# EAGLE design ADC (EAGLE 8.4.2)
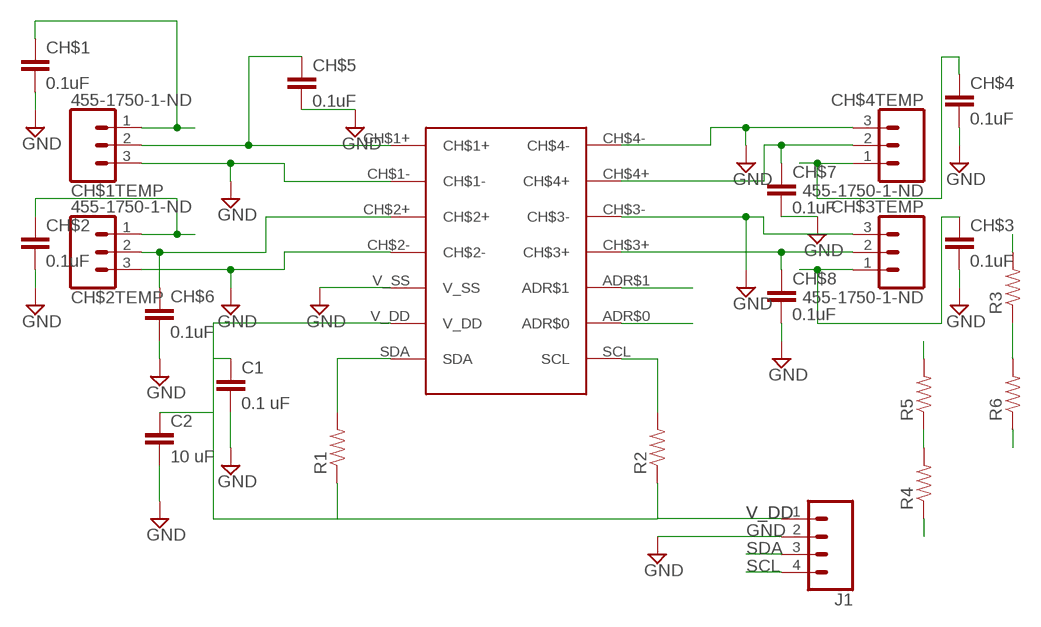
[diagram p0: schematic, sheet 1]

## Parts
C1  0.1 uF  CAPACITOR0805  [0805]
C2  10 uF  CAPACITOR0805  [0805]
CH$1  0.1uF  CAPACITOR0805  [0805]
CH$1TEMP  455-1750-1-ND  CONN_03  [1X03]
CH$2  0.1uF  CAPACITOR0805  [0805]
CH$2TEMP  455-1750-1-ND  CONN_03  [1X03]
CH$3  0.1uF  CAPACITOR0805  [0805]
CH$3TEMP  455-1750-1-ND  CONN_03  [1X03]
CH$4  0.1uF  CAPACITOR0805  [0805]
CH$4TEMP  455-1750-1-ND  CONN_03  [1X03]
CH$5  0.1uF  CAPACITOR0805  [0805]
CH$6  0.1uF  CAPACITOR0805  [0805]
CH$7  0.1uF  CAPACITOR0805  [0805]
CH$8  0.1uF  CAPACITOR0805  [0805]
J1  CONN_04  [1X04]
R1  RESISTOR0805  [0805]
R2  RESISTOR0805  [0805]
R3  RESISTOR0805  [0805]
R4  RESISTOR0805  [0805]
R5  RESISTOR0805  [0805]
R6  RESISTOR0805  [0805]
U$1  MCP3428-E/SL  [MICROCHIP_MCP3428]

## Nets
ADR0: R4.2 R5.1 U$1.ADR$0
ADR1: R3.1 R6.2 U$1.ADR$1
CH$2+: CH$2TEMP.2 CH$6.1 U$1.CH$2+
CH$3+: CH$3TEMP.2 CH$8.1 U$1.CH$3+
CH$4+: CH$4TEMP.2 CH$7.1 U$1.CH$4+
GND: C1.2 C2.2 CH$1.2 CH$1TEMP.3 CH$2.2 CH$2TEMP.3 CH$3.2 CH$3TEMP.3 CH$4.2 CH$4TEMP.3 CH$5.2 CH$6.2 CH$7.2 CH$8.2 J1.2 R4.1 R6.1 U$1.CH$1- U$1.CH$2- U$1.CH$3- U$1.CH$4- U$1.V_SS
N$7: CH$1TEMP.2 CH$5.1 U$1.CH$1+
SCL: J1.4 R2.2 U$1.SCL
SDA: J1.3 R1.2 U$1.SDA
V_DD: C1.1 C2.1 CH$1.1 CH$1TEMP.1 CH$2.1 CH$2TEMP.1 CH$3.1 CH$3TEMP.1 CH$4.1 CH$4TEMP.1 J1.1 R1.1 R2.1 R3.2 R5.2 U$1.V_DD

## Library data of the parts
C1 C2 CH$1-CH$8 = DubSat1 Components:CAPACITOR: Capacitor Standard 0603 ceramic capacitor, and 0.1" leaded capacitor.
CH$1TEMP CH$2TEMP CH$3TEMP CH$4TEMP = SparkFun-Connectors:CONN_03: Multi connection point. Often used as Generic Header-pin footprint for 0.1 inch spaced/style header connections On any of the 0.1 inch spaced packages, you can populate with these: Break Away Headers - Straight <https://www.sparkfun.com/products/116> (PRT-00116) Break Away Male Headers - Right Angle <https://www.sparkfun.com/products/553> (PRT-00553) Female Headers <https://www.sparkfun.com/products/115> (PRT-00115) Break Away Headers - Machine Pin <https://www.sparkfun.com/products/117> (PRT-00117) Break Away Female Headers - Swiss Machine Pin <https://www.sparkfun.com/products/743> (PRT-00743) Stackable Header - 3 Pin (Female, 0.1") <https://www.sparkfun.com/products/13875> (PRT-13875) For SCREWTERMINALS and SPRING TERMINALS visit here: Screw Terimnals on SparkFun.com <https://www.sparkfun.com/search/results?term=Screw+Terminals> (5mm/3.5mm/2.54mm spacing) This device is also useful as a general connection point to wire up your design to another part of your project. Our various solder wires solder well into these plated through hole pads. Hook-Up Wire - Assortment (Stranded, 22 AWG) <https://www.sparkfun.com/products/11375> (PRT-11375) Hook-Up Wire - Assortment (Solid Core, 22 AWG) <https://www.sparkfun.com/products/11367> (PRT-11367) View the entire wire category on our website here <https://www.sparkfun.com/categories/141> Special notes: Molex polarized connector foot print use with SKU : PRT-08232 with associated crimp pins and housings.; PROD_ID: XXX-00000
J1 = SparkFun-Connectors:CONN_04: Multi connection point. Often used as Generic Header-pin footprint for 0.1 inch spaced/style header connections On any of the 0.1 inch spaced packages, you can populate with these: Break Away Headers - Straight <https://www.sparkfun.com/products/116> (PRT-00116) Break Away Male Headers - Right Angle <https://www.sparkfun.com/products/553> (PRT-00553) Female Headers <https://www.sparkfun.com/products/115> (PRT-00115) Break Away Headers - Machine Pin <https://www.sparkfun.com/products/117> (PRT-00117) Break Away Female Headers - Swiss Machine Pin <https://www.sparkfun.com/products/743> (PRT-00743) For SCREWTERMINALS and SPRING TERMINALS visit here: Screw Terimnals on SparkFun.com <https://www.sparkfun.com/search/results?term=Screw+Terminals> (5mm/3.5mm/2.54mm spacing) This device is also useful as a general connection point to wire up your design to another part of your project. Our various solder wires solder well into these plated through hole pads. Hook-Up Wire - Assortment (Stranded, 22 AWG) <https://www.sparkfun.com/products/11375> (PRT-11375) Hook-Up Wire - Assortment (Solid Core, 22 AWG) <https://www.sparkfun.com/products/11367> (PRT-11367) View the entire wire category on our website here <https://www.sparkfun.com/categories/141> Special notes: Molex polarized connector foot print use with SKU : PRT-08231 with associated crimp pins and housings. 1MM SMD Version SKU: PRT-10208; PROD_ID: CONN-09696
R1-R6 = DubSat1 Components:RESISTOR: Resistor Basic schematic elements and footprints for 0603, 1206, and PTH resistors.
U$1 = DubSat1 Components:MCP3428-E/SL

## Board
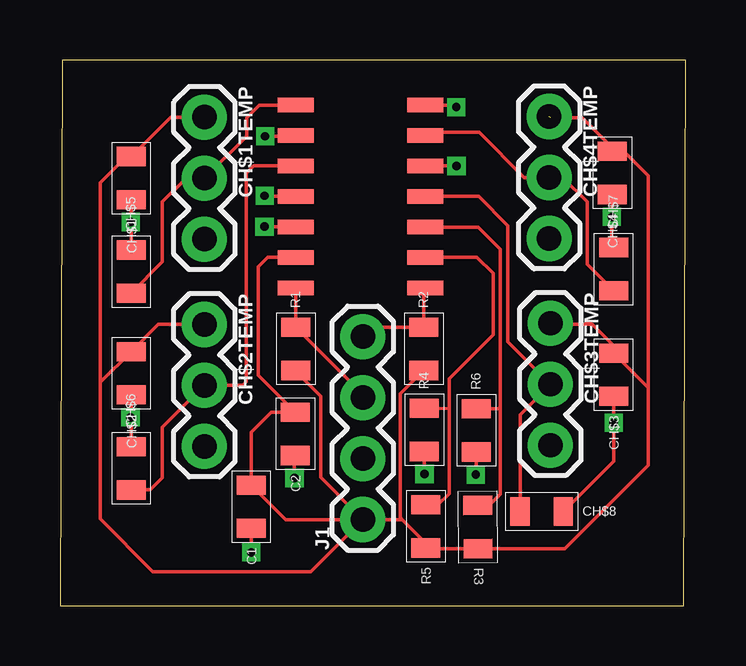
[diagram p1: board, top side]
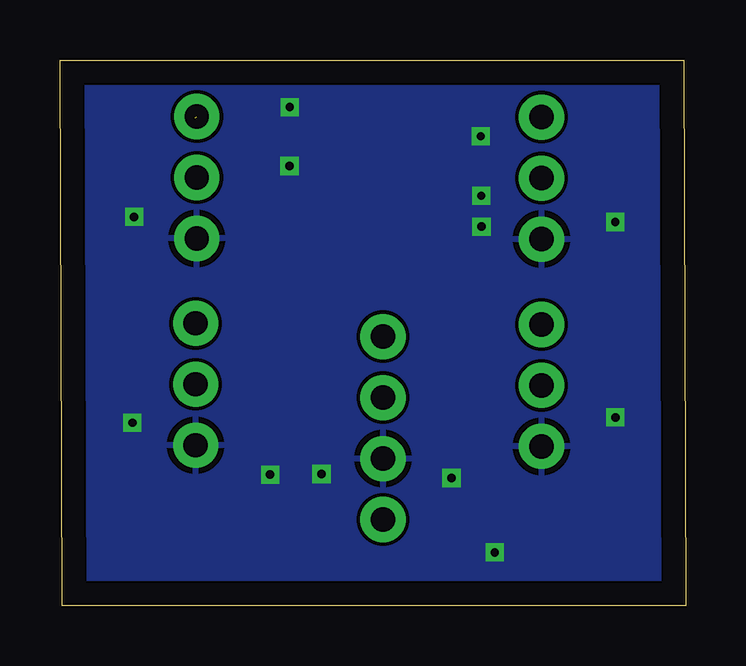
[diagram p2: board, bottom side, seen from below]

Size 26.08 x 22.74 mm. Coordinates in mm from the lower left corner, seen from the top.
Outline: 0,0 25.99,0 26.08,22.74 0.09,22.74 0,0
Copper layers (1*16): Top 0.035mm / dielectric 1.5mm / Bottom 0.035mm
Design rules "default": minimum track width 6mil, minimum drill 0.35mm, track to track 6mil, track to pad 6mil, pad to pad 6mil, via to via 6mil, smd to smd 6mil, copper to edge 40mil, drill to drill 6mil, minimum pad ring 10mil, minimum via ring 8mil, stop-mask expansion 4mil, vias tented up to drill 0mil, thermal gap 10mil

### Footprints (pad centres in the part's own frame; a part is rotated, then mirrored left to right if it is on the bottom)
0805 = smd 0.8 x 1.2: 1 -0.9,0; 2 0.9,0
1X03 = drill 1.016 pad 1.88: 1 0,0; 2 2.54,0; 3 5.08,0
1X04 = drill 1.016 pad 1.88: 1 0,0; 2 2.54,0; 3 5.08,0; 4 7.62,0
MICROCHIP_MCP3428 = smd 1.5 x 0.6: ADR$0 5.4,-6.35; ADR$1 5.4,-5.09; CH$1+ 0,0; CH$1- 0,-1.27; CH$2+ 0,-2.54; CH$2- 0,-3.81; CH$3+ 5.4,-3.81; CH$3- 5.4,-2.54; CH$4+ 5.4,-1.27; CH$4- 5.4,0; SCL 5.4,-7.62; SDA 0,-7.62; V_DD 0,-6.35; V_SS 0,-5.08

### Placement (x,y rotation side)
C1  7.97,4.12 270 top
C2  9.8,7.16 270 top
CH$1  2.97,17.82 270 top
CH$1TEMP  6.02,20.36 270 top
CH$2  2.97,9.69 270 top
CH$2TEMP  6.02,11.72 270 top
CH$3  23.07,9.62 270 top
CH$3TEMP  20.43,11.77 270 top
CH$4  23.01,18.03 270 top
CH$4TEMP  20.38,20.38 270 top
CH$5  2.97,13.92 90 top
CH$6  2.97,5.72 90 top
CH$7  23.07,14.02 90 top
CH$8  20.07,3.92 0 top
J1  12.62,3.59 90 top
R1  9.83,10.7 90 top
R2  15.16,10.7 90 top
R3  17.41,3.28 270.3 top
R4  15.18,7.32 90 top
R5  15.24,3.31 270 top
R6  17.35,7.3 90 top
U$1  9.83,20.86 0 top

### Tracks (layer width: path | path; a pad name or v marks a point on that pad's centre or on a via)
ADR0
  Top 0.152: R4.2 16.21,8.22 | 16.21,8.22 16.21,4.67 15.75,4.21 R5.1 | 16.21,8.22 16.21,9.47 18.04,11.3 18.04,13.85 17.37,14.52 U$1.ADR$0
ADR1
  Top 0.152: 17.35,8.35 R6.2 18.35,8.2 | 18.35,8.2 18.35,4.65 17.88,4.18 R3.1 | 18.35,8.2 18.35,11.17 | 18.35,11.17 | U$1.ADR$1 17.42,15.77 18.35,14.84 18.35,11.17
CH$2+
  Top 0.152: U$1.CH$2+ 9.83,18.45 | 9.83,18.34 U$1.CH$2+ | U$1.CH$2+ 8.07,18.32 7.77,18.02 7.77,9.32 7.62,9.18 CH$2TEMP.2 4.27,7.43 4.27,5.32 3.77,4.82 CH$6.1
CH$3+
  Top 0.152: 15.26,17.02 U$1.CH$3+ 17.44,17.05 18.65,15.84 18.65,11 CH$3TEMP.2 19.17,7.97 CH$8.1
CH$4+
  Top 0.152: U$1.CH$4+ 15.36,19.72 17.47,19.72 19.35,17.84 CH$4TEMP.2 20.95,17.84 21.97,16.82 21.97,14.22 CH$7.1
GND  (via drill 0.35)
  Top 0.152: 2.97,16.01 CH$1.2 | 2.97,16.01 v2.95,15.99 | 2.97,7.88 CH$2.2 | 2.97,7.88 v2.94,7.85 | v8.52,15.8 9.82,15.8 U$1.V_SS | U$1.CH$2- 8.56,17.05 v8.53,17.08 | v8.55,19.56 9.8,19.56 U$1.CH$1- | U$1.CH$3- v16.52,18.32 | U$1.CH$4- 16.42,20.86 v16.51,20.77 | CH$4.2 23.01,16.22 v22.99,16.2 22.99,15 CH$7.2 | R4.1 v15.18,5.5 v15.19,5.49 | C1.2 v7.97,2.22 | C2.2 9.77,6.23 v9.77,5.32 | CH$3.2 v23.07,7.62 23.07,6.02 CH$8.2 | R6.1 17.35,5.49 v17.32,5.46 | CH$6.2 2.97,7.88 | CH$5.2 2.97,16.01
  pour Bottom: 0.17,22.92 26.17,22.92 26.17,-0.08 -0.03,-0.08 -0.03,22.92
N$7
  Top 0.152: 9.8,20.83 U$1.CH$1+ 8.31,20.86 7.77,20.33 7.77,19.57 CH$1TEMP.2 5.26,17.82 4.27,16.82 4.27,14.32 CH$5.1
SCL
  Top 0.152: U$1.SCL 15.16,13.18 R2.2 13.01,11.6 J1.4
SDA
  Top 0.152: U$1.SDA R1.2 12.62,8.81 J1.3
V_DD  (1 unrouted)
  Top 0.152: 24.5,9.09 24.5,17.92 23.5,18.93 CH$4.1 23.01,19.08 21.77,20.32 20.44,20.32 | R5.2 15.27,2.38 15.47,2.38 | 15.47,2.38 R3.2 21.03,2.38 24.5,5.86 24.5,9.09 | U$1.V_DD 8.66,14.51 8.27,14.12 8.27,9.6 C2.1 8.81,8.06 7.97,7.22 C1.1 | 7.97,4.78 C1.1 | C1.1 9.4,3.59 J1.1 | J1.1 10.45,1.42 3.87,1.42 1.67,3.62 1.67,9.32 | 2.63,10.59 CH$2.1 | 1.67,9.32 1.67,17.62 2.76,18.72 CH$1.1 4.61,20.36 CH$1TEMP.1 | CH$2.1 4.1,11.72 CH$2TEMP.1 | 1.67,9.32 1.71,9.32 CH$2.1 | 24.5,9.09 CH$3.1 23.07,10.82 22.17,11.72 20.47,11.72 CH$3TEMP.1 | J1.1 14.26,3.59 | 14.26,3.59 15.47,2.38 | 14.26,3.59 14.17,3.68 14.17,8.82 R2.1 | J1.1 10.87,5.35 10.87,8.72 9.83,9.76 R1.1